# Altium schematic sheet Sheet1.SchDoc
size A
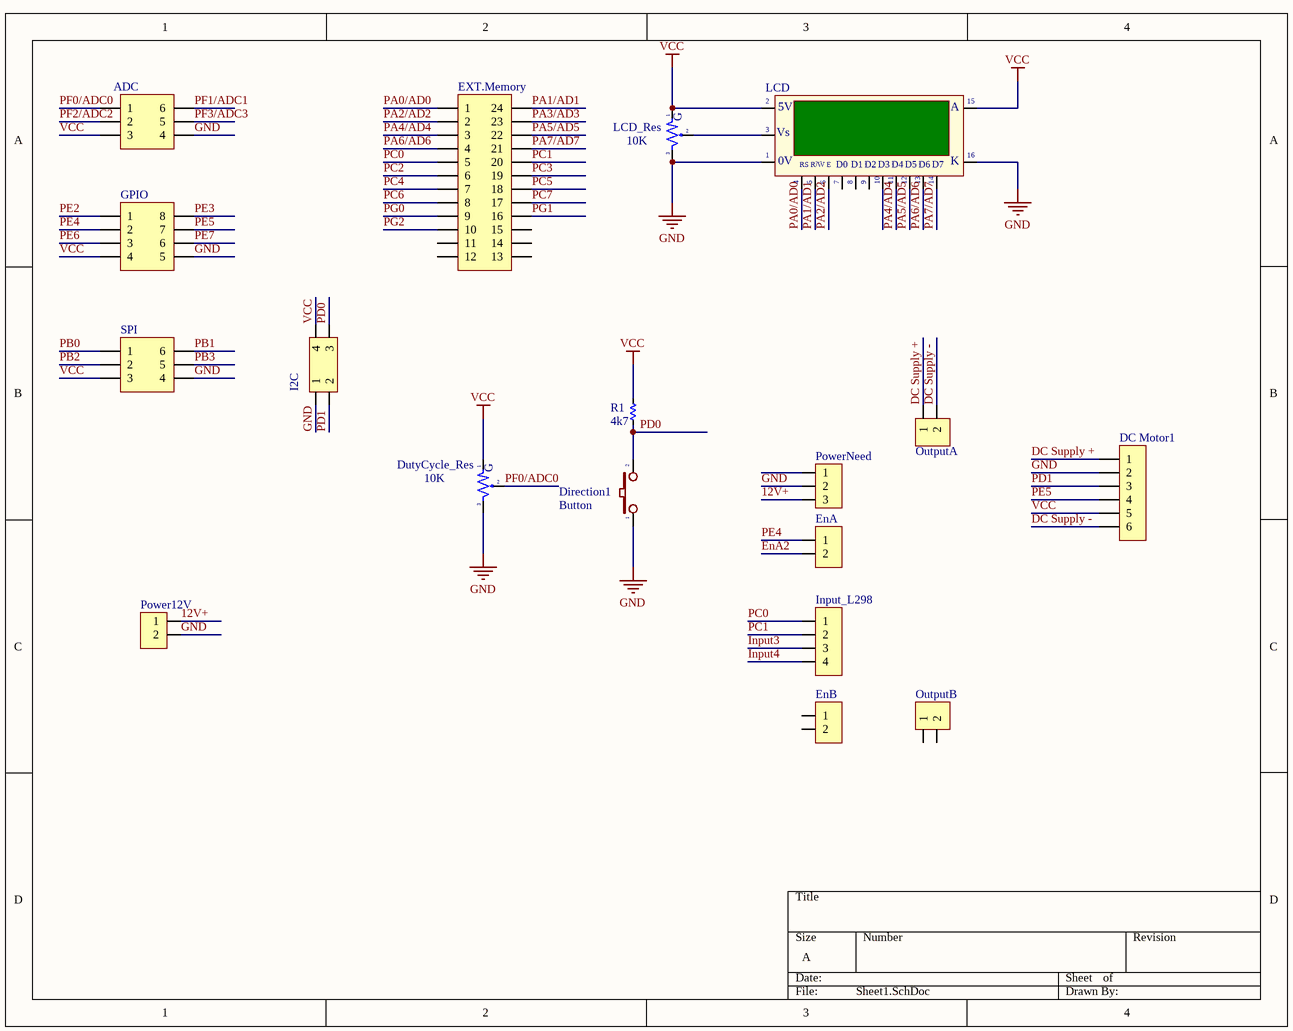
[diagram p0: Sheet1.SchDoc]

## Parts
ADC  (no value)  [JP3-C2T]
DC_Motor1  (no value)  [J6-C1T]
Direction1  Button  [SW-DIP1]
DutyCycle_Res  10K  [VR-S1]
EnA  (no value)  [JP2-D1T]
EnB  (no value)  [JP2-D1T]
EXT.Memory  (no value)  [JP12-C2T]
GPIO  (no value)  [JP4-C2T]
I2C  (no value)  [JP2-C2T]
Input_L298  (no value)  [JP4-C1T]
LCD  (no value)  [LCD16X2]
LCD_Res  10K  [VR-S1]
OutputA  (no value)  [Header2]
OutputB  (no value)  [Header2]
Power12V  (no value)  [Header2]
PowerNeed  (no value)  [HDR3]
R1  4k7  [RES-1/2W]
SPI  (no value)  [JP3-C2T]

## Nets
GND: ADC.4 DC_Motor1.2 Direction1.1 DutyCycle_Res.3 GPIO.5 I2C.1 LCD.1(GND) LCD.16(K) LCD_Res.3 Power12V.2 PowerNeed.2 SPI.4
VCC: ADC.3 DC_Motor1.5 DutyCycle_Res.1 GPIO.4 I2C.4 LCD.2(VDD) LCD.15(A) LCD_Res.1 R1.1 SPI.3
12V+: Power12V.1 PowerNeed.3
DC Supply +: DC_Motor1.1 OutputA.1
DC Supply -: DC_Motor1.6 OutputA.2
EnA2: EnA.2
Input3: Input_L298.3
Input4: Input_L298.4
PA0/AD0: EXT.Memory.1 LCD.4(RS)
PA1/AD1: EXT.Memory.24 LCD.5(R/~{W})
PA2/AD2: EXT.Memory.2 LCD.6(~{EN})
PA3/AD3: EXT.Memory.23
PA4/AD4: EXT.Memory.3 LCD.11(D4)
PA5/AD5: EXT.Memory.22 LCD.12(D5)
PA6/AD6: EXT.Memory.4 LCD.13(D6)
PA7/AD7: EXT.Memory.21 LCD.14(D7)
PB0: SPI.1
PB1: SPI.6
PB2: SPI.2
PB3: SPI.5
PC0: EXT.Memory.5 Input_L298.1
PC1: EXT.Memory.20 Input_L298.2
PC2: EXT.Memory.6
PC3: EXT.Memory.19
PC4: EXT.Memory.7
PC5: EXT.Memory.18
PC6: EXT.Memory.8
PC7: EXT.Memory.17
PD0: Direction1.2 I2C.3 R1.2
PD1: DC_Motor1.3 I2C.2
PE2: GPIO.1
PE3: GPIO.8
PE4: EnA.1 GPIO.2
PE5: DC_Motor1.4 GPIO.7
PE6: GPIO.3
PE7: GPIO.6
PF0/ADC0: ADC.1 DutyCycle_Res.2
PF1/ADC1: ADC.6
PF2/ADC2: ADC.2
PF3/ADC3: ADC.5
PG0: EXT.Memory.9
PG1: EXT.Memory.16
PG2: EXT.Memory.10
NetLCD_3: LCD.3(VEE) LCD_Res.2

Not connected (* = marked no-connect by the designer): EnB 1 2; EXT.Memory 11 12 13 14 15; LCD 7(D0) 8(D1) 9(D2) 10(D3); OutputB 1 2; PowerNeed 1

## Notes on the sheet
- (in symbol LCD16x2A) 5V; Vs; |; 0V; R/W; E
- (in symbol VR-S) G

## Library data of the parts
ADC SPI = JP3x2: WR-PHD 2.54 mm Dual Socket Header; Manufacturer: W¨¹rth Elektronik eiSos GmbH; partNo: 61300621821; ComponentLink1 Description: Manufacturer; ComponentLink2 Description: Datasheet; NoPins: 06; Created Date: 29 March 2013; ComponentLink1URL: http://www.we-online.com; ComponentLink2URL: http://katalog.we-online.de/em/datasheet/6130xx21821.pdf; Created by: Karrer Zheng
DC_Motor1 = JP6x1-2.0: WR-PHD 2.00 mm Socket Header; Manufacturer: W¨¹rth Elektronik eiSos GmbH; partNo: 62000611821; ComponentLink1 Description: Manufacturer; ComponentLink2 Description: Datasheet; NoPins: 06; Created Date: 2 April 2013; ComponentLink1URL: http://www.we-online.com; ComponentLink2URL: http://katalog.we-online.de/em/datasheet/6200xx11821.pdf; Created by: Karrer Zheng
Direction1 = SW2: Switch button 2 pin; Value: SW chip 2 pin
DutyCycle_Res LCD_Res = VR-S: Var Resistor; Value: Volume 50k
EnA EnB = JP2: WR-PHD 2.54 mm Angled Socket Header; Manufacturer: W¨¹rth Elektronik eiSos GmbH; partNo: 613002143121; ComponentLink1 Description: Manufacturer; ComponentLink2 Description: Datasheet; NoPins: 02; Created Date: 29 March 2013; ComponentLink1URL: http://www.we-online.com; ComponentLink2URL: http://katalog.we-online.de/em/datasheet/6130xx143121.pdf; Created by: Karrer Zheng
EXT.Memory = JP12x2: WR-PHD 2.54 mm Dual Socket Header; Manufacturer: W¨¹rth Elektronik eiSos GmbH; partNo: 61302421821; ComponentLink1 Description: Manufacturer; ComponentLink2 Description: Datasheet; NoPins: 24; Created Date: 29 March 2013; ComponentLink1URL: http://www.we-online.com; ComponentLink2URL: http://katalog.we-online.de/em/datasheet/6130xx21821.pdf; Created by: Karrer Zheng
GPIO = JP4x2: WR-PHD 2.54 mm Dual Socket Header; Manufacturer: W¨¹rth Elektronik eiSos GmbH; partNo: 61300821821; ComponentLink1 Description: Manufacturer; ComponentLink2 Description: Datasheet; NoPins: 08; Created Date: 29 March 2013; ComponentLink1URL: http://www.we-online.com; ComponentLink2URL: http://katalog.we-online.de/em/datasheet/6130xx21821.pdf; Created by: Karrer Zheng
I2C = JP2x2: WR-PHD 2.54 mm Dual Socket Header; Manufacturer: W¨¹rth Elektronik eiSos GmbH; partNo: 61300421821; ComponentLink1 Description: Manufacturer; ComponentLink2 Description: Datasheet; NoPins: 04; Created Date: 29 March 2013; ComponentLink1URL: http://www.we-online.com; ComponentLink2URL: http://katalog.we-online.de/em/datasheet/6130xx21821.pdf; Created by: Karrer Zheng
Input_L298 = JP4: WR-PHD 2.54 mm Angled Socket Header; Manufacturer: W¨¹rth Elektronik eiSos GmbH; partNo: 613004143121; ComponentLink1 Description: Manufacturer; ComponentLink2 Description: Datasheet; NoPins: 04; Created Date: 29 March 2013; ComponentLink1URL: http://www.we-online.com; ComponentLink2URL: http://katalog.we-online.de/em/datasheet/6130xx143121.pdf; Created by: Karrer Zheng
LCD = LCD16x2A: LCD dipslay 16 char, 2 line; Value: LCD16x2A
OutputA OutputB Power12V = Header2: Header IDC, 2 x 1 Pin Vertical 2.54mm Pitch (Non-Boxed, Male); Manufacturer: W¨¹rth Elektronik eiSos GmbH; partNo: 613002143121; ComponentLink1 Description: Manufacturer; ComponentLink2 Description: Datasheet; NoPins: 02; Created Date: 29 March 2013; ComponentLink1URL: http://www.we-online.com; ComponentLink2URL: http://katalog.we-online.de/em/datasheet/6130xx143121.pdf; Created by: Karrer Zheng
PowerNeed = Header3: Header IDC, 3 x 1 Pin Vertical 2.54mm Pitch (Non-Boxed, Male); Manufacturer: W¨¹rth Elektronik eiSos GmbH; partNo: 613002143121; ComponentLink1 Description: Manufacturer; ComponentLink2 Description: Datasheet; NoPins: 02; Created Date: 29 March 2013; ComponentLink1URL: http://www.we-online.com; ComponentLink2URL: http://katalog.we-online.de/em/datasheet/6130xx143121.pdf; Created by: Karrer Zheng
R1 = Res: Manufacturer: Generic Components; Class: Passive; SubClass: R; Published: 08/06/2000; Publisher: Altium Hobart Technology Centre